# EAGLE design lightmeter_1 (EAGLE 9.6.2)
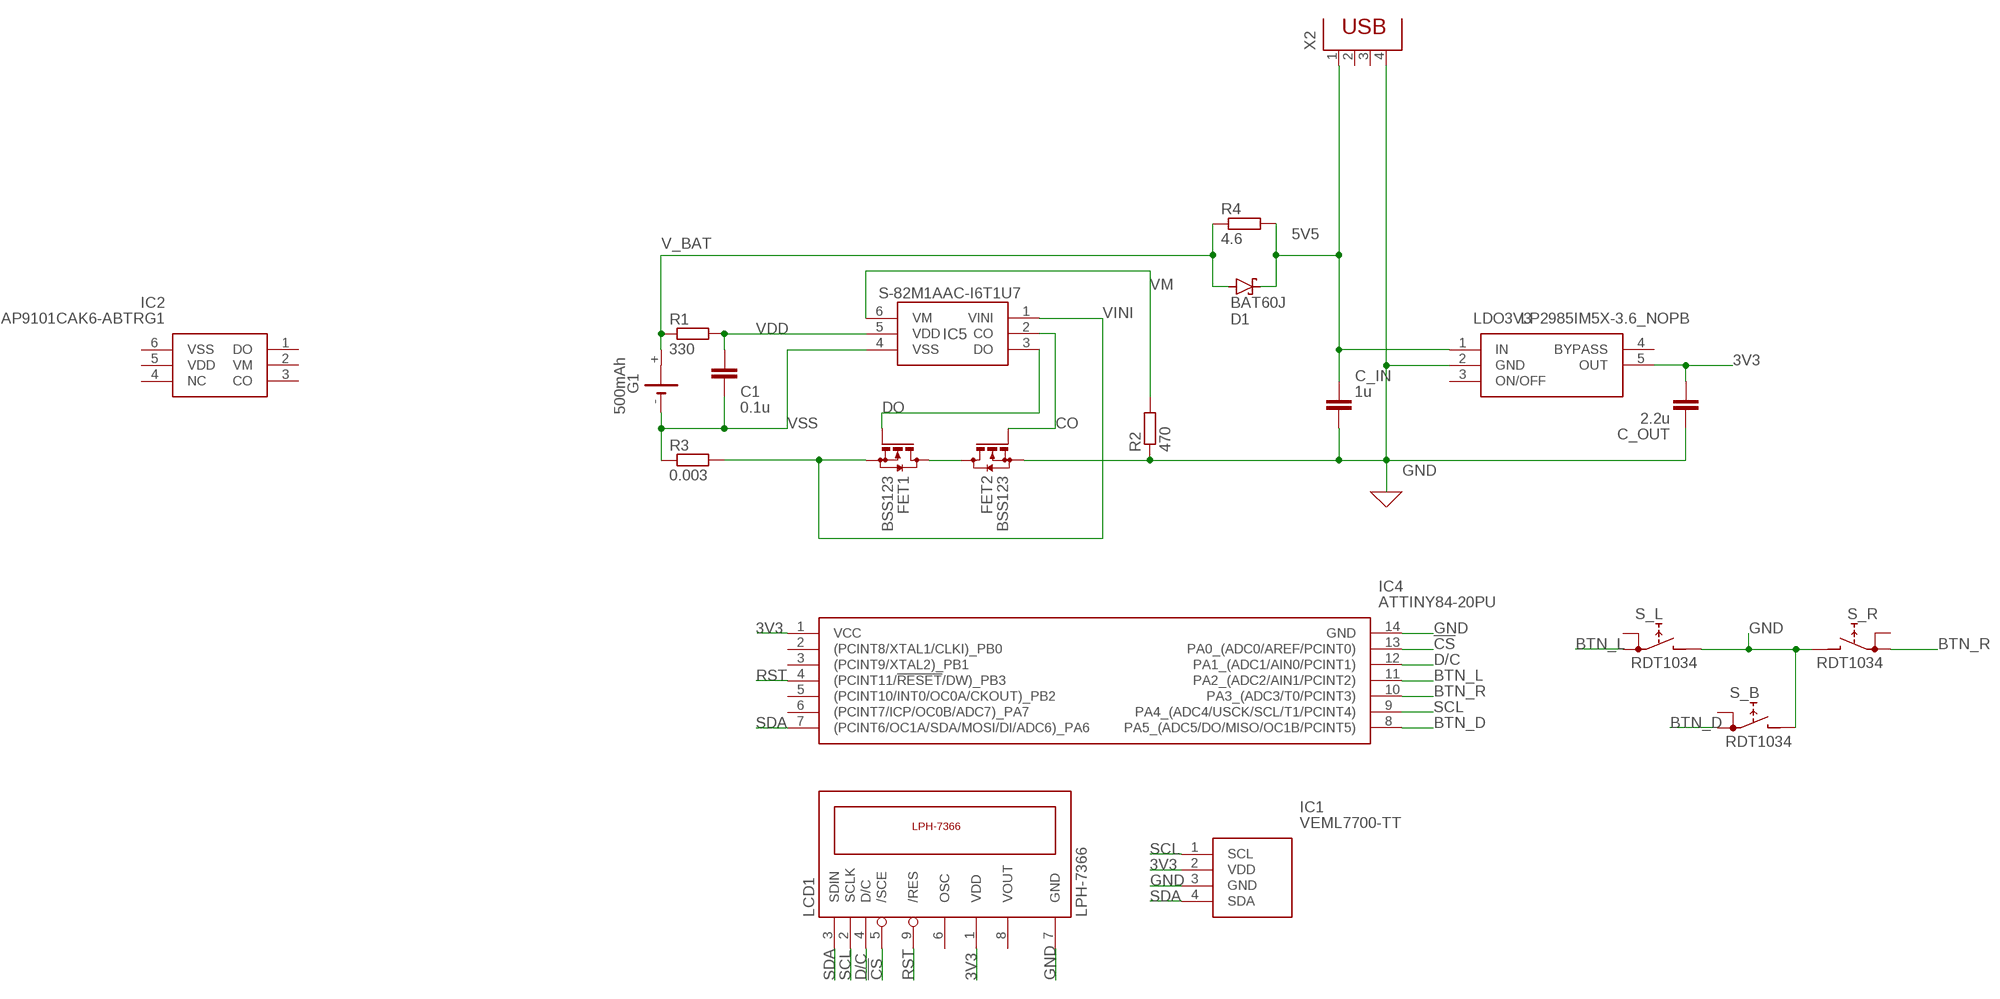
[diagram p0: schematic, sheet 1]

## Parts
C1  0.1u  C  (no package)
C_IN  1u  C  (no package)
C_OUT  2.2u  C  (no package)
D1  BAT60J  [SOD323_ST]
FET1  BSS123  [SOT23]
FET2  BSS123  [SOT23]
G1  500mAh  CR1/2  [CR1/2]
IC1  VEML7700-TT  [VEML7700]
IC2  AP9101CAK6-ABTRG1  [SOT95P285X140-6N]
IC4  ATTINY84-20PU  [DIP794W56P254L1918H533Q14N]
IC5  S-82M1AAC-I6T1U7  [SON50P170X157X48-6N]
LCD1  LPH-7366  [LPH-7366]
LDO3V3  LP2985IM5X-3.6_NOPB  [SOT95P280X145-5N]
R1  330  R-EU_R3216W  [R3216W]
R2  470  R-EU_R3216W  [R3216W]
R3  0.003  R-EU_R3216W  [R3216W]
R4  4.6  R-EU_R3216W  [R3216W]
S_B  RDT1034  [RDT1034]
S_L  RDT1034  [RDT1034]
S_R  RDT1034  [RDT1034]
X2  PN87520  [PN87520]

## Nets
3V3: C_OUT.2 IC1.2(VDD) IC4.1(VCC) LCD1.1(VDD) LDO3V3.5(OUT)
5V5: C_IN.1 D1.C LDO3V3.1(IN) R4.2 X2.1
!CS: IC4.13(PA0_(ADC0/AREF/PCINT0)) LCD1.5(/SCE)
BTN_D: IC4.8(PA5_(ADC5/DO/MISO/OC1B/PCINT5)) S_B.A1
BTN_L: IC4.11(PA2_(ADC2/AIN1/PCINT2)) S_L.A1
BTN_R: IC4.10(PA3_(ADC3/T0/PCINT3)) S_R.A1
CO: FET2.1(G) IC5.2(CO)
D/C: IC4.12(PA1_(ADC1/AIN0/PCINT1)) LCD1.4(D/C)
DO: FET1.1(G) IC5.3(DO)
GND: C_IN.2 C_OUT.1 FET2.2(S) IC1.3(GND) IC4.14(GND) LCD1.7(GND) LDO3V3.2(GND) R2.1 S_B.B S_L.B S_R.B X2.4
N$5: FET1.3(D) FET2.3(D)
RST: IC4.4((PCINT11/!RESET!/DW)_PB3) LCD1.9(/RES)
SCL: IC1.1(SCL) IC4.9(PA4_(ADC4/USCK/SCL/T1/PCINT4)) LCD1.2(SCLK)
SDA: IC1.4(SDA) IC4.7((PCINT6/OC1A/SDA/MOSI/DI/ADC6)_PA6) LCD1.3(SDIN)
V_BAT: D1.A G1.+ R1.1 R4.1
VDD: C1.1 IC5.5(VDD) R1.2
VINI: FET1.2(S) IC5.1(VINI) R3.2
VM: IC5.6(VM) R2.2
VSS: C1.2 G1.- IC5.4(VSS) R3.1
Unconnected: G1.+@1(+) IC2.1(DO) IC2.2(VM) IC2.3(CO) IC2.4(NC) IC2.5(VDD) IC2.6(VSS) IC4.2((PCINT8/XTAL1/CLKI)_PB0) IC4.3((PCINT9/XTAL2)_PB1) IC4.5((PCINT10/INT0/OC0A/CKOUT)_PB2) IC4.6((PCINT7/ICP/OC0B/ADC7)_PA7) LCD1.6(OSC) LCD1.8(VOUT) LDO3V3.3(ON/OFF) LDO3V3.4(BYPASS) S_B.A S_L.A S_R.A X2.2 X2.3

## Library data of the parts
C1 C_IN C_OUT = ngspice-simulation:C: CAPACITOR
D1 = diode:BAT60J: Schottky barrier diode Source: www.st.com, BAT60J.pdf
FET1 FET2 = transistor-small-signal:BSS123: N-CHANNEL MOS FET
G1 = battery:CR1/2: LI BATTERY Sonnenschein SL-350 PT
IC1 = SamacSys_Parts:VEML7700-TT: 16Bit Ambient Light Sensor I2C 6.8x2.3mm Source: Datasheet <https://www.arrow.com/en/products/veml7700-tt/vishay>; DESCRIPTION: 16Bit Ambient Light Sensor I2C 6.8x2.3mm; HEIGHT: mm; MANUFACTURER_NAME: Vishay; MANUFACTURER_PART_NUMBER: VEML7700-TT; MOUSER_PART_NUMBER: 78-VEML7700-TT; MOUSER_PRICE-STOCK: https://www.mouser.co.uk/ProductDetail/Vishay-Semiconductors/VEML7700-TT?qs=BcfjnG7NVaXdL6DJFdWbdw%3D%3D
IC2 = SamacSys_Parts:AP9101CAK6-ABTRG1: Battery Management Protection IC 1-Cell LI 3.0uA 3.5V Source: Datasheet <https://www.diodes.com/assets/Datasheets/AP9101C.pdf>; DESCRIPTION: Battery Management Protection IC 1-Cell LI 3.0uA 3.5V; HEIGHT: 1.4mm; MANUFACTURER_NAME: Diodes Inc.; MANUFACTURER_PART_NUMBER: AP9101CAK6-ABTRG1; MOUSER_PART_NUMBER: 621-AP9101CAK6ABTRG1; MOUSER_PRICE-STOCK: https://www.mouser.com/Search/Refine.aspx?Keyword=621-AP9101CAK6ABTRG1
IC4 = SamacSys_Parts:ATTINY84-20PU: Microcontroller AVR, 8KB FLASH, 512B EE ATTINY84-20PU, 8 bit AVR Microcontroller 20MHz 512 B, 8 kB Flash, 512 B RAM, I2C 14-Pin PDIP Source: Datasheet <https://datasheet.datasheetarchive.com/originals/distributors/Datasheets_SAMA/1a4ee99e4eb61e76f001b846a746d522.pdf>; DESCRIPTION: Microcontroller AVR, 8KB FLASH, 512B EE ATTINY84-20PU, 8 bit AVR Microcontroller 20MHz 512 B, 8 kB Flash, 512 B RAM, I2C 14-Pin PDIP; HEIGHT: 5.334mm; MANUFACTURER_NAME: Microchip; MANUFACTURER_PART_NUMBER: ATTINY84-20PU; MOUSER_PART_NUMBER: 556-ATTINY84-20PU; MOUSER_PRICE-STOCK: https://www.mouser.co.uk/ProductDetail/Microchip-Technology-Atmel/ATTINY84-20PU?qs=2nyfZ6BV3ohef4pLj0igDg%3D%3D
IC5 = SamacSys_Parts:S-82M1AAC-I6T1U7: Battery Management BATTERY PROTECTION IC FOR 1 CELL PACK Source: Datasheet <https://www.mouser.de/datasheet/2/360/S82M1A_E-2492186.pdf>; DESCRIPTION: Battery Management BATTERY PROTECTION IC FOR 1 CELL PACK; HEIGHT: 0.48mm; MANUFACTURER_NAME: ABLIC Inc.; MANUFACTURER_PART_NUMBER: S-82M1AAC-I6T1U7
LCD1 = lph-7366:LPH-7366
LDO3V3 = SamacSys_Parts:LP2985IM5X-3.6_NOPB: Micropower 150-mA Low-Noise Ultra-Low-Dropout Regulator in SOT-23 packages Source: Datasheet <http://www.ti.com/lit/gpn/lp2985-n>; DESCRIPTION: Micropower 150-mA Low-Noise Ultra-Low-Dropout Regulator in SOT-23 packages; HEIGHT: 1.45mm; MANUFACTURER_NAME: Texas Instruments; MANUFACTURER_PART_NUMBER: LP2985IM5X-3.6/NOPB; MOUSER_PART_NUMBER: 926-LP2985IM5X36NOPB; MOUSER_PRICE-STOCK: https://www.mouser.co.uk/ProductDetail/Texas-Instruments/LP2985IM5X-36-NOPB?qs=7lkVKPoqpbYgOQm7zq4eUg%3D%3D
R1-R4 = rcl:R-EU_: RESISTOR, European symbol; SPICEPREFIX: R
S_B S_L S_R = switch:RDT1034: PUSH SWITCH www.radiohm.com
X2 = con-berg:PN87520: BERG USB connector; OC_FARNELL: unknown; OC_NEWARK: unknown

## Board
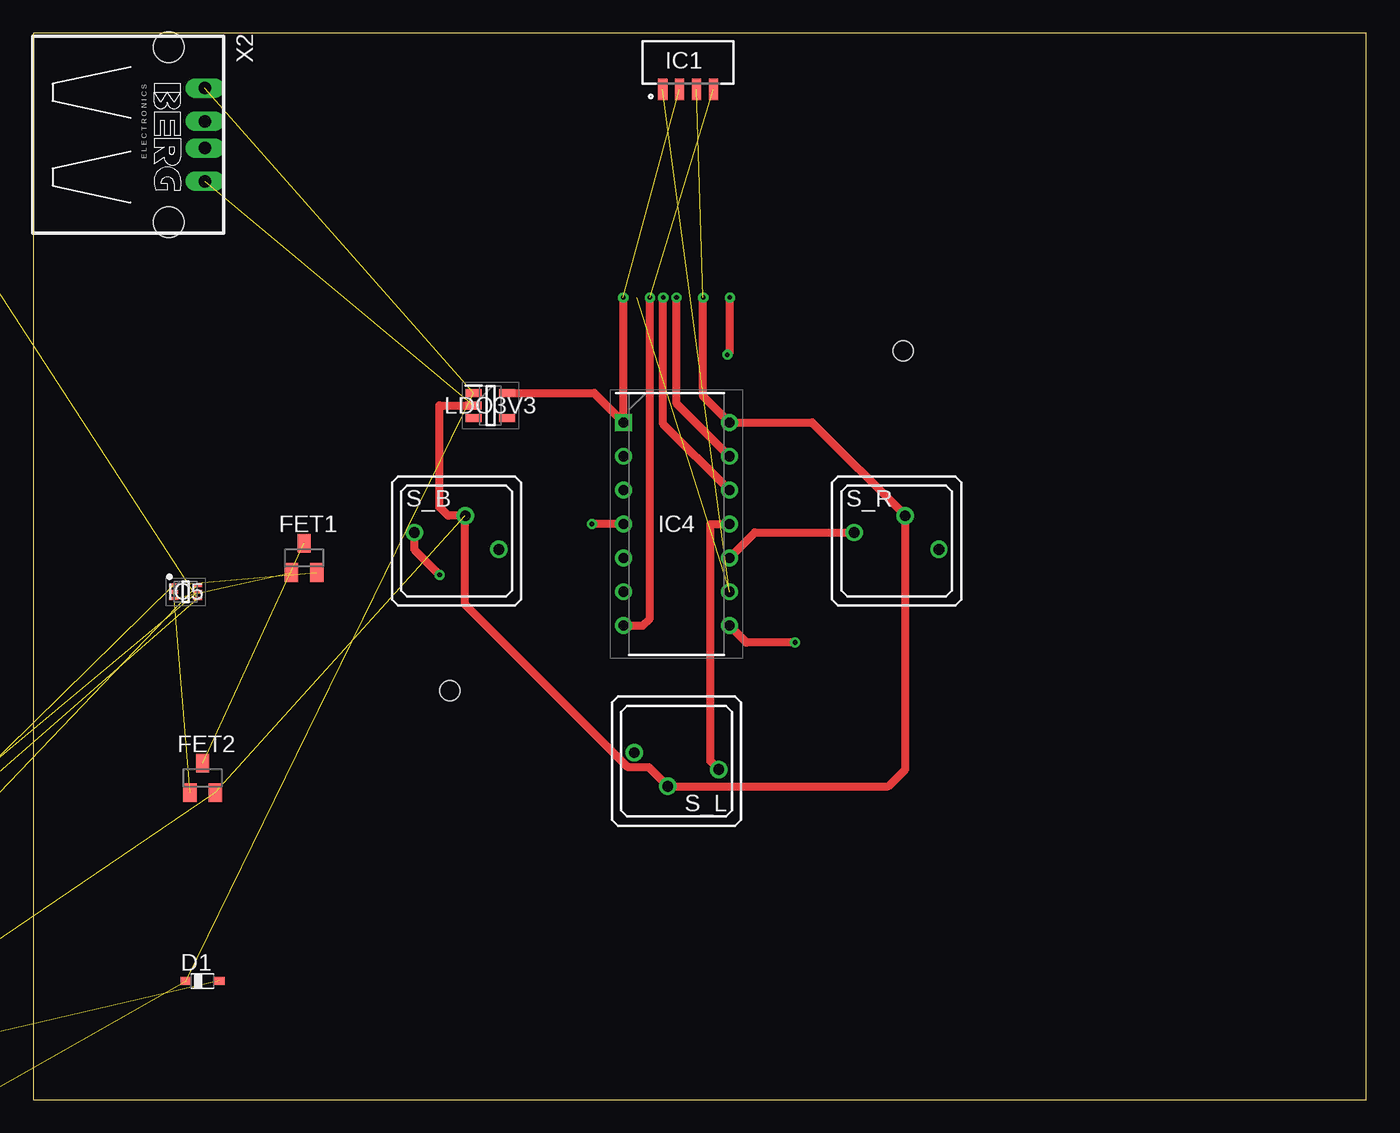
[diagram p1: board, top side]
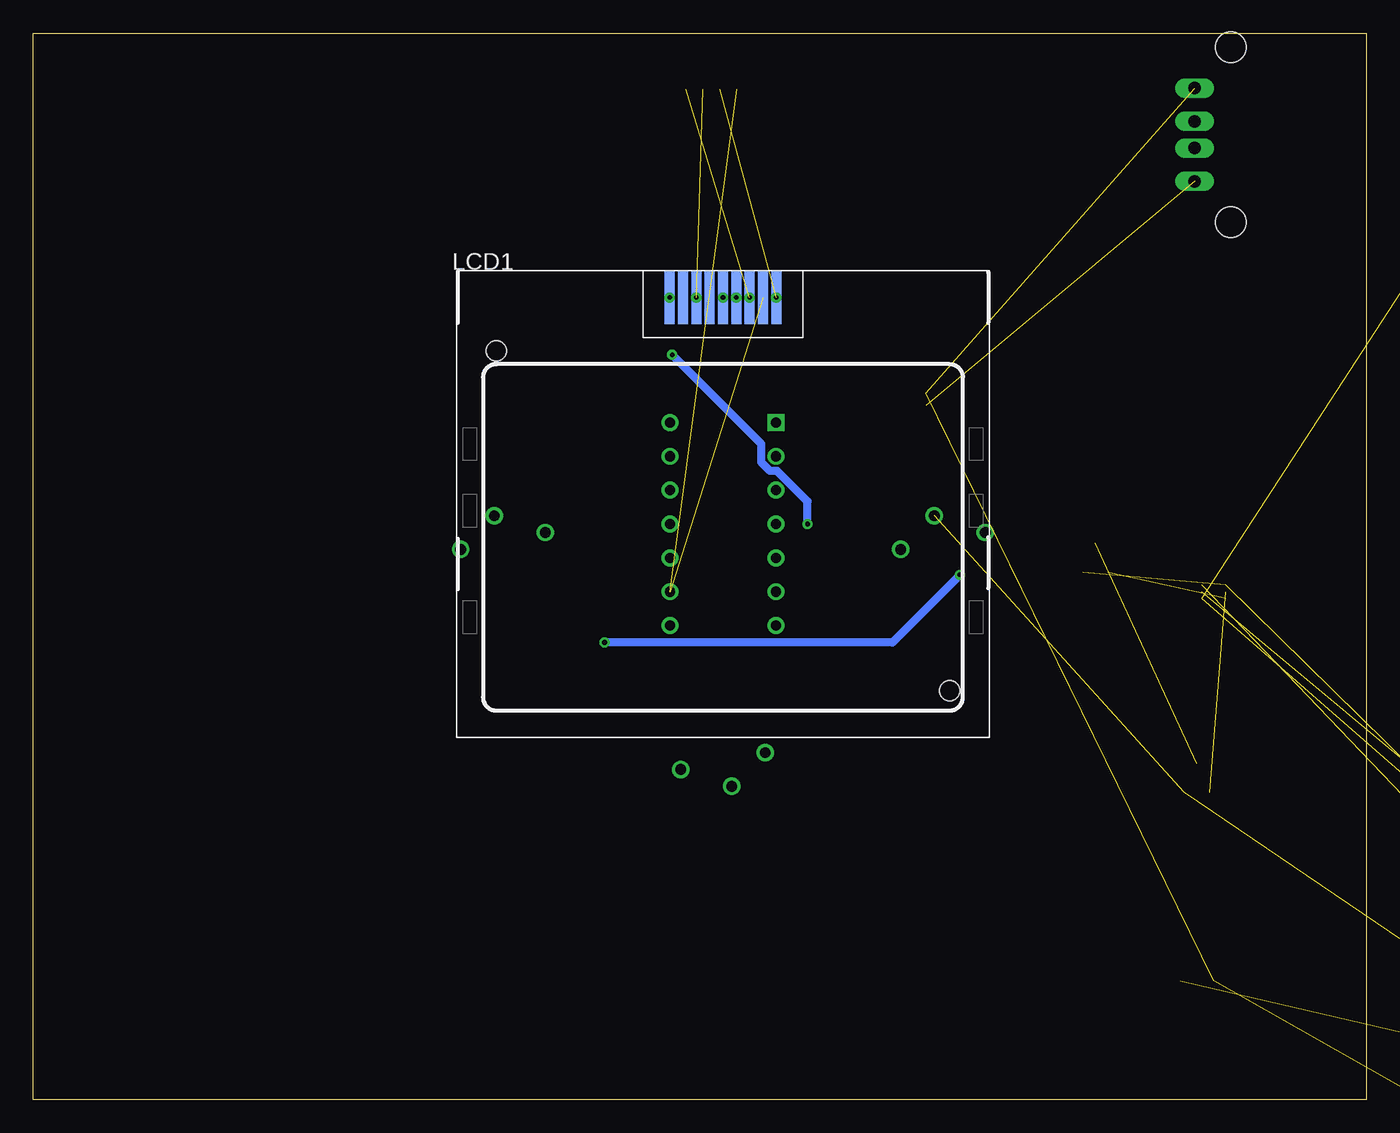
[diagram p2: board, bottom side, seen from below]

Size 100 x 80 mm. Coordinates in mm from the lower left corner, seen from the top.
Outline: 0,0 100,0 100,80 0,80 0,0
Copper layers (1*16): Top 0.035mm / dielectric 1.5mm / Bottom 0.035mm
Design rules "default": minimum track width 6mil, minimum drill 0.35mm, track to track 6mil, track to pad 6mil, pad to pad 6mil, via to via 6mil, smd to smd 6mil, copper to edge 40mil, drill to drill 6mil, minimum pad ring 10mil, minimum via ring 8mil, stop-mask expansion 4mil, vias tented up to drill 0mil, thermal gap 10mil

### Footprints (pad centres in the part's own frame; a part is rotated, then mirrored left to right if it is on the bottom)
SOD323_ST = smd 0.8 x 0.6: A 1.25,0; C -1.25,0
SOT23 = smd 1 x 1.4: 1 -0.95,-1.1; 2 0.95,-1.1; 3 0,1.1
CR1/2 = drill 1.321 pad 3.15 octagon: + -12.7,-5.08; +@1 -12.7,5.08; - 12.7,0
VEML7700 = smd 0.7 x 1.6: 1 1.495,-0.4; 2 2.765,-0.4; 3 4.035,-0.4; 4 5.305,-0.4
SOT95P285X140-6N = smd 1.15 x 0.6: 1 -1.3,0.95; 2 -1.3,0; 3 -1.3,-0.95; 4 1.3,-0.95; 5 1.3,0; 6 1.3,0.95
DIP794W56P254L1918H533Q14N = drill 0.759 pad 1.159 square: 1 -3.969,7.62 | drill 0.759 pad 1.159: 2 -3.969,5.08; 3 -3.969,2.54; 4 -3.969,0; 5 -3.969,-2.54; 6 -3.969,-5.08; 7 -3.969,-7.62; 8 3.969,-7.62; 9 3.969,-5.08; 10 3.969,-2.54; 11 3.969,0; 12 3.969,2.54; 13 3.969,5.08; 14 3.969,7.62
SON50P170X157X48-6N = smd 0.65 x 0.25: 1 -0.9,0.5; 2 -0.9,0; 3 -0.9,-0.5; 4 0.9,-0.5; 5 0.9,0; 6 0.9,0.5
LPH-7366 = smd 0.75 x 4: 1 4,17; 2 3,17; 3 2,17; 4 1,17; 5 0,17; 6 -1,17; 7 -2,17; 8 -3,17; 9 -4,17 | hole 1.5: -17,13; 17,-12.5
SOT95P280X145-5N = smd 1.2 x 0.6: 1 -1.25,0.95; 2 -1.25,0; 3 -1.25,-0.95; 4 1.25,-0.95; 5 1.25,0.95
R3216W = smd 1.8 x 1.2: 1 -1.499,0; 2 1.499,0
RDT1034 = drill 0.8: A 3.175,-0.635; A1 -3.175,0.635; B 0.65,1.9
PN87520 = drill 0.95 long: 1 -3.5,2.71; 2 -1,2.71; 3 1,2.71; 4 3.5,2.71 | hole 2.3: -6.57,0; 6.57,0

### Placement (x,y rotation side)
D1  12.7,8.89 0 top
FET1  20.32,40.64 0 top
FET2  12.7,24.13 0 top
G1  -27.94,80.01 0 top  (outside the outline)
IC1  45.72,76.2 0 top
IC2  -38.1,-24.13 0 top  (outside the outline)
IC4  48.26,43.18 0 top
IC5  11.43,38.1 0 top
LCD1  48.26,43.18 0 bottom
LDO3V3  34.29,52.07 0 top
R1  -39.37,-3.81 0 top  (outside the outline)
R2  -39.37,-13.97 0 top  (outside the outline)
R3  -39.37,-8.89 0 top  (outside the outline)
R4  -39.37,-19.05 0 top  (outside the outline)
S_B  31.75,41.91 0 top
S_L  48.26,25.4 180 top
S_R  64.77,41.91 0 top
X2  10.16,72.39 270 top

### Tracks (layer width: path | path; a pad name or v marks a point on that pad's centre or on a via)
3V3  (via drill 0.35)  (1 unrouted)
  Top 0.61: LDO3V3.5 42.07,53.02 IC4.1 44.29,60.15 LCD1.1
  other vias: 44.26,60.18
5V5  (3 unrouted)
!CS  (via drill 0.35)
  Top 0.61: IC4.13 48.26,52.23 LCD1.5
  other vias: 48.26,60.18
BTN_D  (via drill 0.35)
  Top 0.61: S_B.A1 28.57,41.27 v30.48,39.37 | v57.15,34.29 53.5,34.29 IC4.8
  Bottom 0.61: v30.48,39.37 35.56,34.29 v57.15,34.29
BTN_L
  Top 0.61: S_L.A1 50.8,25.4 50.8,43.18 IC4.11
BTN_R
  Top 0.61: IC4.10 54.13,42.55 S_R.A1
CO  (1 unrouted)
D/C  (via drill 0.35)
  Top 0.61: IC4.12 47.26,50.69 LCD1.4
  other vias: 47.26,60.18
DO  (1 unrouted)
GND  (via drill 0.35)  (4 unrouted)
  Top 0.61: LDO3V3.2 30.48,52.07 30.48,44.45 31.12,43.81 S_B.B 32.4,37.15 44.62,24.92 46.19,24.92 S_L.B 64.14,23.5 65.42,24.78 S_R.B 58.43,50.8 IC4.14 50.26,52.77 LCD1.7
  other vias: 50.26,60.18
N$5  (1 unrouted)
RST  (via drill 0.35)
  Top 0.61: IC4.4 v41.91,43.18 | v52.07,55.88 52.26,56.07 LCD1.9
  Bottom 0.61: v52.07,55.88 45.38,49.19 45.38,47.81 44.74,47.17 44.2,47.17 41.91,44.88 v41.91,43.18
  other vias: 52.26,60.18
SCL  (2 unrouted)
SDA  (via drill 0.35)  (1 unrouted)
  Top 0.61: IC4.7 45.72,35.56 46.26,36.1 LCD1.3
  other vias: 46.26,60.18
V_BAT  (3 unrouted)
VDD  (1 unrouted)
VINI  (2 unrouted)
VM  (1 unrouted)
VSS  (2 unrouted)